# EAGLE schematic schematic (EAGLE 8.0.1)
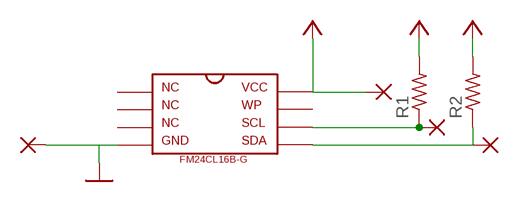
[diagram p0: schematic, sheet 1]

## Parts
GND  SMD2  [SMD1,27-2,54]
R1  R-US_M0805  [M0805]
R2  R-US_M0805  [M0805]
SCL  SMD2  [SMD1,27-2,54]
SDA  SMD2  [SMD1,27-2,54]
U$1  FM24CL16B-G  [FM24CL16B-G]
VCC  SMD2  [SMD1,27-2,54]

## Nets
+3V3: R1.2 R2.2 U$1.8 VCC.1(P)
GND: GND.1(P) U$1.4
N$4: R1.1 SCL.1(P) U$1.6
N$5: R2.1 SDA.1(P) U$1.5
Unconnected: U$1.1 U$1.2 U$1.3 U$1.7

## Library data of the parts
GND SCL SDA VCC = wirepad:SMD2: SMD PAD
R1 R2 = adafruit:R-US_: RESISTOR, American symbol
U$1 = FM24CL16B-G_fram:FM24CL16B-G: 16-Kbit (2K × 8) Serial (I2C) F-RAM